# Altium schematic sheet battery monitor.SchDoc
size A4
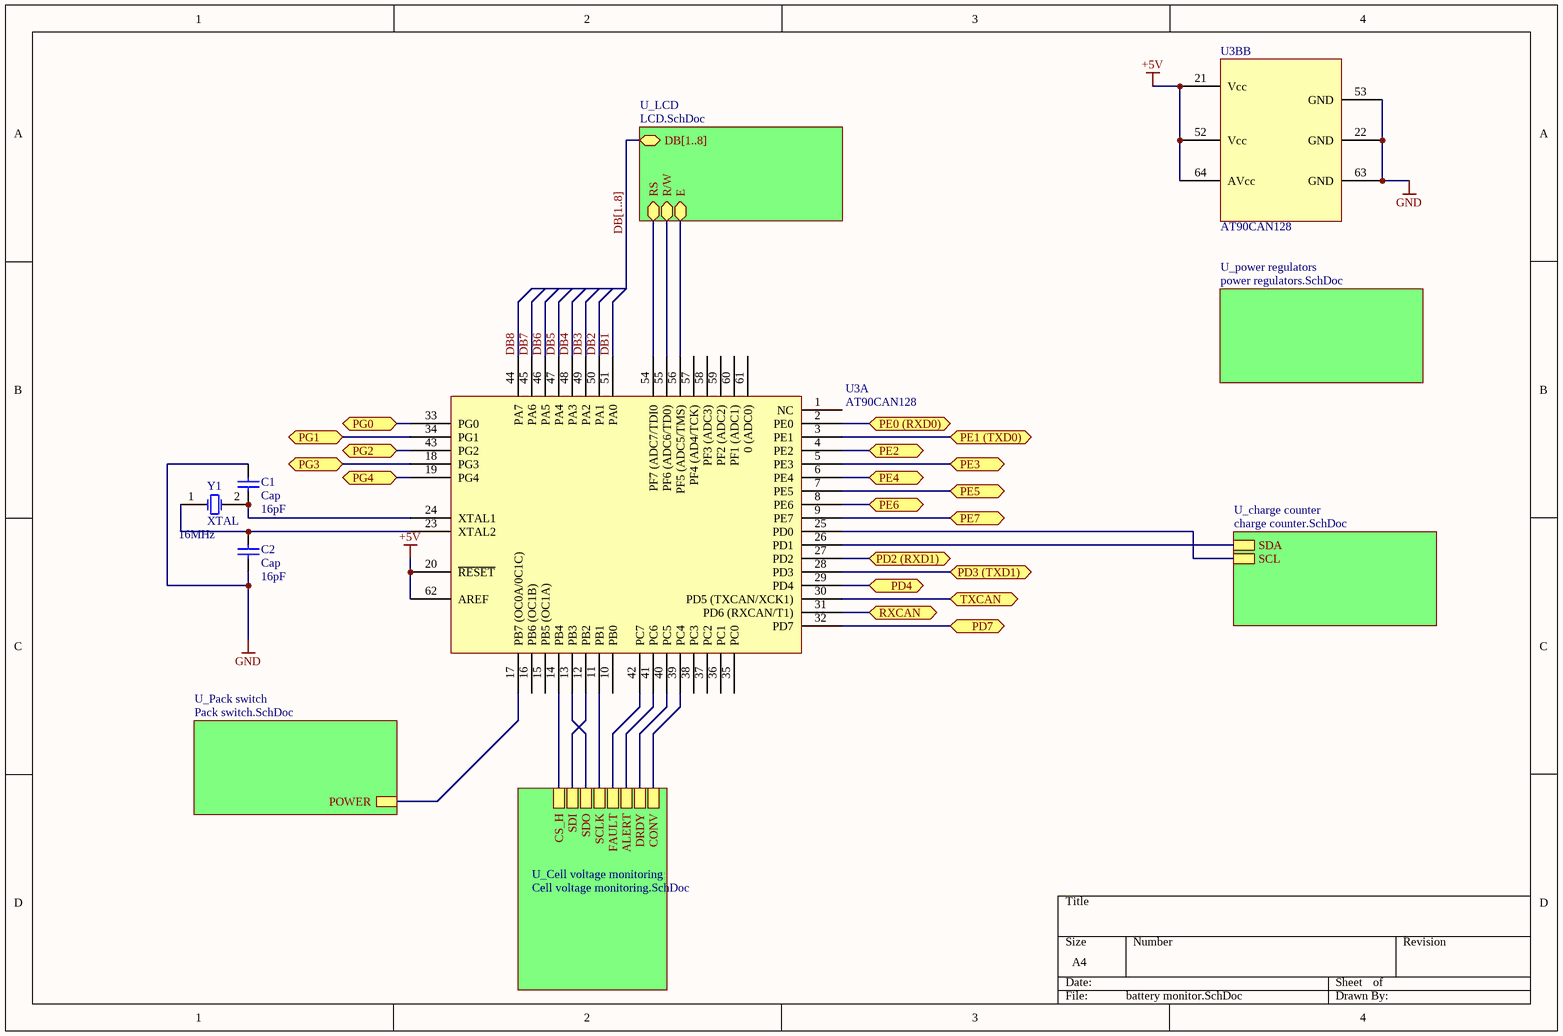
[diagram p0: battery monitor.SchDoc]

## Parts
C1  Cap  value 16pF  [C0805]
C2  Cap  value 16pF  [C0805]
U3  AT90CAN128  [TQFP80P1600X1600X120-64N]  (part A of 2)
U3B  AT90CAN128  [TQFP80P1600X1600X120-64N]  (part B of 2)
Y1  XTAL  value 16MHz  [R38]

## Sub-sheets
U_Cell voltage monitoring = Cell voltage monitoring.SchDoc: CONV, DRDY, ALERT, FAULT, SCLK, SDO, SDI, CS_H
U_charge counter = charge counter.SchDoc: SDA, SCL
U_LCD = LCD.SchDoc: DB[1..8] (bidir), RS, R/W, E
U_Pack switch = Pack switch.SchDoc: POWER
U_power regulators = power regulators.SchDoc: no entries

## Ports
PD2 (RXD1), PD3 (TXD1), PD4, PD7, PE0 (RXD0), PE1 (TXD0), PE2, PE3, PE4 (bidir), PE5, PE6, PE7, PG0, PG1, PG2, PG3, PG4, RXCAN, TXCAN

## Nets
+5V: U3.20(~{RESET}) U3.62(AREF) U3B.21(Vcc) U3B.52(Vcc) U3B.64(AVcc)
GND: C1.2 C2.2 U3B.22(GND) U3B.53(GND) U3B.63(GND)
DB1: U3.51(PA0)
DB2: U3.50(PA1)
DB3: U3.49(PA2)
DB4: U3.48(PA3)
DB5: U3.47(PA4)
DB6: U3.46(PA5)
DB7: U3.45(PA6)
DB8: U3.44(PA7)
PD2 (RXD1): U3.27(PD2) ; port PD2 (RXD1)
PD3 (TXD1): U3.28(PD3) ; port PD3 (TXD1)
PD4: U3.29(PD4) ; port PD4
PD7: U3.32(PD7) ; port PD7
PE0 (RXD0): U3.2(PE0) ; port PE0 (RXD0)
PE1 (TXD0): U3.3(PE1) ; port PE1 (TXD0)
PE2: U3.4(PE2) ; port PE2
PE3: U3.5(PE3) ; port PE3
PE4: U3.6(PE4) ; port PE4
PE5: U3.7(PE5) ; port PE5
PE6: U3.8(PE6) ; port PE6
PE7: U3.9(PE7) ; port PE7
PG0: U3.33(PG0) ; port PG0
PG1: U3.34(PG1) ; port PG1
PG2: U3.43(PG2) ; port PG2
PG3: U3.18(PG3) ; port PG3
PG4: U3.19(PG4) ; port PG4
RXCAN: U3.31(PD6_(RXCAN/T1)) ; port RXCAN
TXCAN: U3.30(PD5_(TXCAN/XCK1)) ; port TXCAN
NetC1_1: C1.1 U3.24(XTAL1) Y1.2(OSC2)
NetC2_1: C2.1 U3.23(XTAL2) Y1.1(OSC1)
NetU3_11: U3.11(PB1) ; sheet U_Cell voltage monitoring/SCLK
NetU3_12: U3.12(PB2) ; sheet U_Cell voltage monitoring/SDI
NetU3_13: U3.13(PB3) ; sheet U_Cell voltage monitoring/SDO
NetU3_14: U3.14(PB4) ; sheet U_Cell voltage monitoring/CS_H
NetU3_17: U3.17(PB7_(OC0A/0C1C)) ; sheet U_Pack switch/POWER
NetU3_25: U3.25(PD0) ; sheet U_charge counter/SCL
NetU3_26: U3.26(PD1) ; sheet U_charge counter/SDA
NetU3_39: U3.39(PC4) ; sheet U_Cell voltage monitoring/CONV
NetU3_40: U3.40(PC5) ; sheet U_Cell voltage monitoring/DRDY
NetU3_41: U3.41(PC6) ; sheet U_Cell voltage monitoring/ALERT
NetU3_42: U3.42(PC7) ; sheet U_Cell voltage monitoring/FAULT
NetU3_54: U3.54(PF7_(ADC7/TDI0) ; sheet U_LCD/RS
NetU3_55: U3.55(PF6_(ADC6/TD0)) ; sheet U_LCD/R/W
NetU3_56: U3.56(PF5_(ADC5/TMS)) ; sheet U_LCD/E

Not connected (* = marked no-connect by the designer): U3 1(NC) 10(PB0) 15(PB5_(OC1A)) 16(PB6_(OC1B)) 35(PC0) 36(PC1) 37(PC2) 38(PC3) 57(PF4_(AD4/TCK)) 58(PF3_(ADC3)) 59(PF2_(ADC2)) 60(PF1_(ADC1)) 61(0_(ADC0))

## Buses and harness runs
bus DB[1..8] = sheet U_LCD/DB[1..8]

## Library data of the parts
C1 C2 = Cap: Capacitor; Published: 8-Jun-2000; LatestRevisionDate: 17-Jul-2002; LatestRevisionNote: Re-released for DXP Platform.; PackageReference: RAD-0.3; Publisher: Altium Limited; PackageDescription: Radial Cap, Thru-Hole; 2 Leads; 0.3 in Pin Spacing
Y1 = XTAL: Crystal Oscillator; Published: 8-Jun-2000; LatestRevisionDate: 17-Jul-2002; LatestRevisionNote: Re-released for DXP Platform.; PackageReference: R38; Publisher: Altium Limited; farnell: 1842294rl